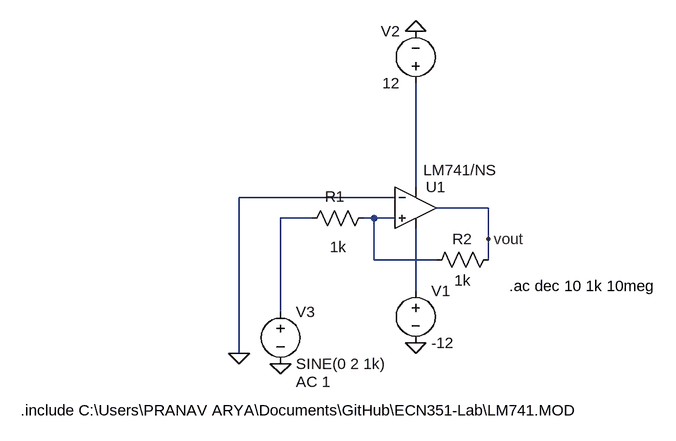
[diagram p0: schematic Non-invertor Amplifier.asc]
Non-invertor Amplifier.asc, the LTspice schematic file:
Version 4
SHEET 1 880 680
WIRE 272 96 272 -64
WIRE 240 112 0 112
WIRE 384 128 304 128
WIRE 112 144 64 144
WIRE 208 144 192 144
WIRE 240 144 208 144
WIRE 384 176 384 128
WIRE 208 208 208 144
WIRE 304 208 208 208
WIRE 384 208 384 176
WIRE 272 256 272 160
WIRE 64 288 64 144
WIRE 0 352 0 112
FLAG 272 336 0
FLAG 272 -144 0
FLAG 64 368 0
FLAG 0 352 0
FLAG 384 176 vout
SYMBOL OpAmps\\opamp2 272 64 R0
WINDOW 3 12 6 Left 2
SYMATTR Value LM741/NS
SYMATTR InstName U1
SYMBOL voltage 272 240 R0
WINDOW 123 0 0 Left 0
WINDOW 39 0 0 Left 0
SYMATTR InstName V1
SYMATTR Value -12
SYMBOL voltage 272 -48 R180
WINDOW 0 24 96 Left 2
WINDOW 3 24 16 Left 2
WINDOW 123 0 0 Left 0
WINDOW 39 0 0 Left 0
SYMATTR InstName V2
SYMATTR Value 12
SYMBOL res 208 128 R90
WINDOW 0 -2 60 VBottom 2
WINDOW 3 45 55 VTop 2
SYMATTR InstName R1
SYMATTR Value 1k
SYMBOL res 400 192 R90
WINDOW 0 0 56 VBottom 2
WINDOW 3 32 56 VTop 2
SYMATTR InstName R2
SYMATTR Value 1k
SYMBOL voltage 64 272 R0
WINDOW 123 24 124 Left 2
WINDOW 39 0 0 Left 0
SYMATTR Value2 AC 1
SYMATTR InstName V3
SYMATTR Value SINE(0 2 1k)
TEXT -336 440 Left 2 !.include C:\\Users\\PRANAV ARYA\\Documents\\GitHub\\ECN351-Lab\\LM741.MOD
TEXT 416 248 Left 2 !.ac dec 10 1k 10meg

The netlist it stands for:
* Non-invertor Amplifier.asc
XU1 N003 0 N001 N004 vout LM741/NS  ; pins In+ In- V+ V- OUT
V1 N004 0 -12
V2 N001 0 12
R1 N003 N002 1k
R2 vout N003 1k
V3 N002 0 SINE(0 2 1k) AC 1
.include C:\Users\PRANAV ARYA\Documents\GitHub\ECN351-Lab\LM741.MOD
.ac dec 10 1k 10meg
.backanno
.end